# Altium schematic sheet dac.SchDoc
size 209 x 297 mm
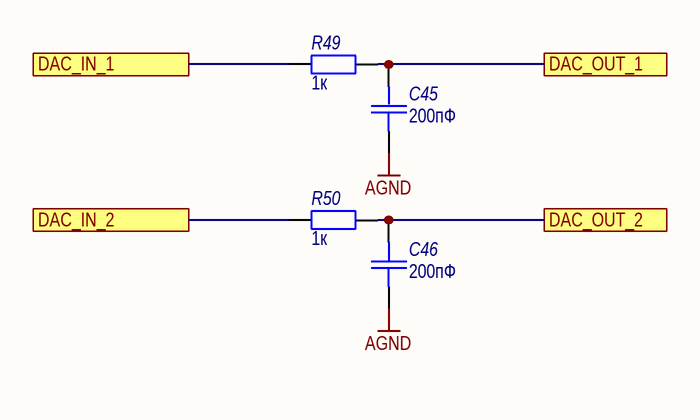
[diagram p0: dac.SchDoc]

## Parts
C45  200пФ  [SMD_0805]
C46  200пФ  [SMD_0805]
R49  1к  [SMD_0603]
R50  1к  [SMD_0603]

## Ports
DAC_IN_1, DAC_IN_2, DAC_OUT_1, DAC_OUT_2

## Nets
AGND: C45.1 C46.1
DAC_IN_1: R49.1 ; port DAC_IN_1
DAC_IN_2: R50.1 ; port DAC_IN_2
DAC_OUT_1: C45.2 R49.2 ; port DAC_OUT_1
DAC_OUT_2: C46.2 R50.2 ; port DAC_OUT_2

## Notes on the sheet
- Подп. и дата
- Инв. № дубл.
- Взам. инв. №
- Инв. № подл.
- Изм.
- Лист
- № докум.
- Подп.
- Дата
- Форма 2а ГОСТ 2.104-2006
- Копировал
- Формат А4

## Library data of the parts
C45 C46 = Capacitor: Назначение: SMD-конденсатор; Наименование: Конденсатор; Потребление, Вт: 0; Value: 0,1мкФ
R49 R50 = Resistor: Наименование: Резистор; Назначение: SMD-резистор; Потребление, Вт: 0,001; Value: 1к